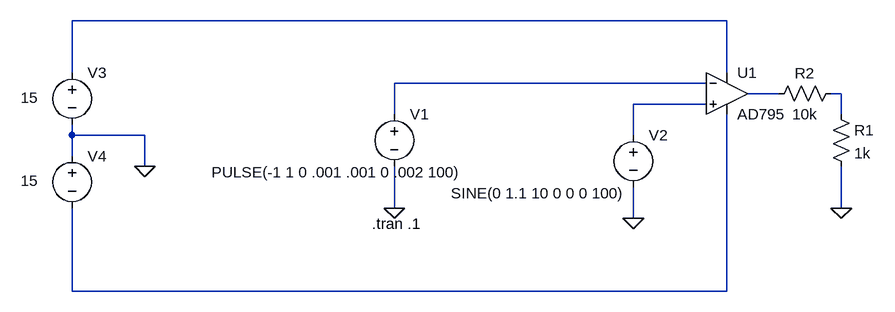
[diagram p0: schematic PWM.asc]
PWM.asc, the LTspice schematic file:
Version 4
SHEET 1 880 680
WIRE 544 -32 -464 -32
WIRE -464 48 -464 -32
WIRE 544 48 544 -32
WIRE 512 64 32 64
WIRE 624 80 576 80
WIRE 720 80 704 80
WIRE 512 96 400 96
WIRE 32 112 32 64
WIRE 720 112 720 80
WIRE -464 144 -464 128
WIRE -352 144 -464 144
WIRE 400 144 400 96
WIRE -464 176 -464 144
WIRE -352 192 -352 144
WIRE 32 256 32 192
WIRE 720 256 720 192
WIRE 400 272 400 224
WIRE -464 384 -464 256
WIRE 544 384 544 112
WIRE 544 384 -464 384
FLAG 32 256 0
FLAG 400 272 0
FLAG -352 192 0
FLAG 720 256 0
SYMBOL voltage 32 96 R0
WINDOW 3 -281 105 Left 2
WINDOW 123 0 0 Left 2
WINDOW 39 0 0 Left 2
SYMATTR InstName V1
SYMATTR Value PULSE(-1 1 0 .001 .001 0 .002 100)
SYMBOL voltage 400 128 R0
WINDOW 3 -281 105 Left 2
WINDOW 123 0 0 Left 2
WINDOW 39 0 0 Left 2
SYMATTR InstName V2
SYMATTR Value SINE(0 1.1 10 0 0 0 100)
SYMBOL Opamps\\AD795 544 16 R0
SYMATTR InstName U1
SYMBOL voltage -464 32 R0
WINDOW 3 -79 54 Left 2
WINDOW 123 0 0 Left 2
WINDOW 39 0 0 Left 2
SYMATTR InstName V3
SYMATTR Value 15
SYMBOL voltage -464 160 R0
WINDOW 3 -79 54 Left 2
WINDOW 123 0 0 Left 2
WINDOW 39 0 0 Left 2
SYMATTR InstName V4
SYMATTR Value 15
SYMBOL res 704 96 R0
SYMATTR InstName R1
SYMATTR Value 1k
SYMBOL res 720 64 R90
WINDOW 0 0 56 VBottom 2
WINDOW 3 32 56 VTop 2
SYMATTR InstName R2
SYMATTR Value 10k
TEXT -2 280 Left 2 !.tran .1

The netlist it stands for:
* PWM.asc
V1 N002 0 PULSE(-1 1 0 .001 .001 0 .002 100)
V2 N005 0 SINE(0 1.1 10 0 0 0 100)
XU1 N005 N002 N001 N006 N003 AD795  ; pins In+ In- V+ V- OUT
V3 N001 0 15
V4 0 N006 15
R1 N004 0 1k
R2 N004 N003 10k
.tran .1
.lib ADI1.lib
.backanno
.end